# Altium project 继电器控制模块.PrjPCB
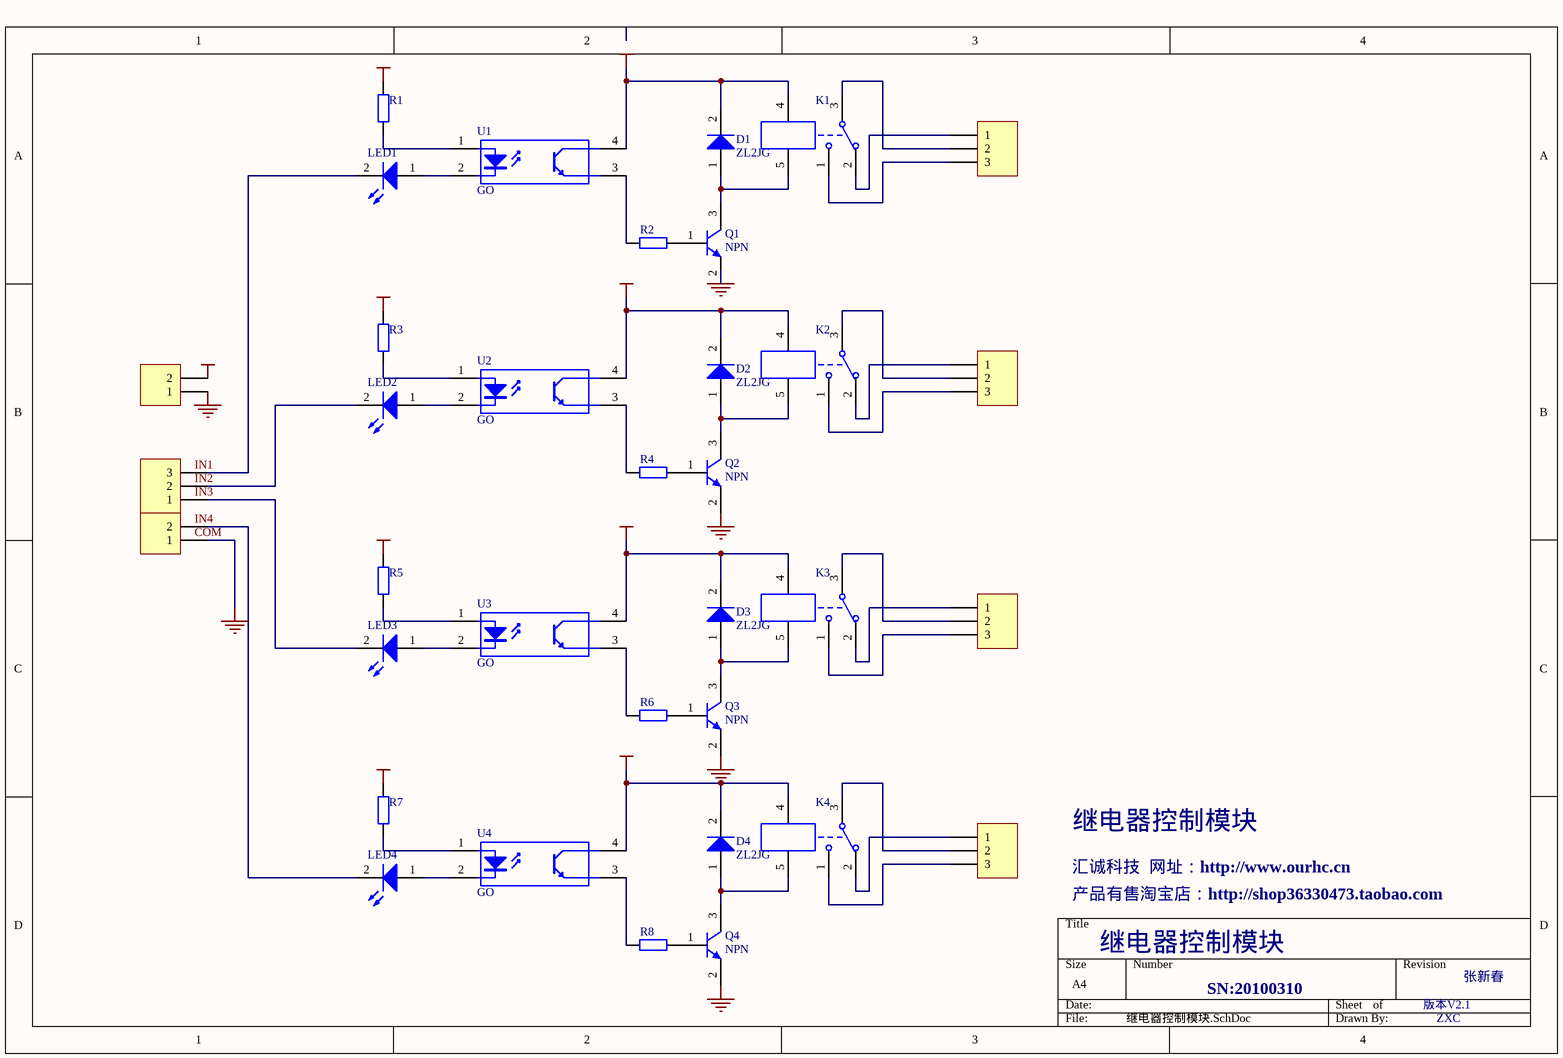
[diagram p0: 继电器控制模块.SchDoc]
1 sheet, 35 parts. Net scope: global (net labels, ports and power ports of the same name join across sheets).
Board file: 继电器控制模块.PcbDoc

## Sheet 继电器控制模块.SchDoc
size A4

### Parts
D1  ZL2JG  [TPDR]
D2  ZL2JG  [TPDR]
D3  ZL2JG  [TPDR]
D4  ZL2JG  [TPDR]
IN1  PZ_3  [JK128_3]  (value not drawn)
IN2  PZ_2  [JK128_2]  (value not drawn)
K1  JDQYCK  [JQC-3F/T73]  (value not drawn)
K2  JDQYCK  [JQC-3F/T73]  (value not drawn)
K3  JDQYCK  [JQC-3F/T73]  (value not drawn)
K4  JDQYCK  [JQC-3F/T73]  (value not drawn)
LED1  (no value)  [TP-0805-D]
LED2  (no value)  [TP-0805-D]
LED3  (no value)  [TP-0805-D]
LED4  (no value)  [TP-0805-D]
OUT1  PZ_3  [JK128_3]  (value not drawn)
OUT2  PZ_3  [JK128_3]  (value not drawn)
OUT3  PZ_3  [JK128_3]  (value not drawn)
OUT4  PZ_3  [JK128_3]  (value not drawn)
POWER  PZ_2  [JK128_2]  (value not drawn)
Q1  NPN  [SO-G3]
Q2  NPN  [SO-G3]
Q3  NPN  [SO-G3]
Q4  NPN  [SO-G3]
R1  Res  [TP-0805-R]  (value not drawn)
R2  Res  [TP-0805-R]  (value not drawn)
R3  Res  [TP-0805-R]  (value not drawn)
R4  Res  [TP-0805-R]  (value not drawn)
R5  Res  [TP-0805-R]  (value not drawn)
R6  Res  [TP-0805-R]  (value not drawn)
R7  Res  [TP-0805-R]  (value not drawn)
R8  Res  [TP-0805-R]  (value not drawn)
U1  GO  [DIP-4]
U2  GO  [DIP-4]
U3  GO  [DIP-4]
U4  GO  [DIP-4]

### Nets
GND: IN2.1 POWER.1 Q1.2(E) Q2.2(E) Q3.2(E) Q4.2(E)
VCC: D1.2(K) D2.2(K) D3.2(K) D4.2(K) K1.4 K2.4 K3.4 K4.4 POWER.2 R1.2 R3.2 R5.2 R7.2 U1.4(C) U2.4(C) U3.4(C) U4.4(C)
NetD1_1: D1.1(A) K1.5 Q1.3(C)
NetD2_1: D2.1(A) K2.5 Q2.3(C)
NetD3_1: D3.1(A) K3.5 Q3.3(C)
NetD4_1: D4.1(A) K4.5 Q4.3(C)
NetIN1_1: IN1.1 LED3.2(K)
NetIN1_2: IN1.2 LED2.2(K)
NetIN1_3: IN1.3 LED1.2(K)
NetIN2_2: IN2.2 LED4.2(K)
NetK1_1: K1.1 OUT1.3
NetK1_2: K1.2 OUT1.1
NetK1_3: K1.3 OUT1.2
NetK2_1: K2.1 OUT2.3
NetK2_2: K2.2 OUT2.1
NetK2_3: K2.3 OUT2.2
NetK3_1: K3.1 OUT3.3
NetK3_2: K3.2 OUT3.1
NetK3_3: K3.3 OUT3.2
NetK4_1: K4.1 OUT4.3
NetK4_2: K4.2 OUT4.1
NetK4_3: K4.3 OUT4.2
NetLED1_1: LED1.1(A) U1.2(K)
NetLED2_1: LED2.1(A) U2.2(K)
NetLED3_1: LED3.1(A) U3.2(K)
NetLED4_1: LED4.1(A) U4.2(K)
NetQ1_1: Q1.1(B) R2.1
NetQ2_1: Q2.1(B) R4.1
NetQ3_1: Q3.1(B) R6.1
NetQ4_1: Q4.1(B) R8.1
NetR1_1: R1.1 U1.1(A)
NetR2_2: R2.2 U1.3(E)
NetR3_1: R3.1 U2.1(A)
NetR4_2: R4.2 U2.3(E)
NetR5_1: R5.1 U3.1(A)
NetR6_2: R6.2 U3.3(E)
NetR7_1: R7.1 U4.1(A)
NetR8_2: R8.2 U4.3(E)

### Notes on the sheet
- 继电器控制模块
- 汇诚科技  网址：http://www.ourhc.cn
- 产品有售淘宝店：http://shop36330473.taobao.com
- SN:20100310
- 版本V2.1
- 张新春
- ZXC
- Labels drawn without touching a wire or pin: COM, IN1, IN2, IN3, IN4

### Library data of the parts
D1-D4 = ZL2JG: 整流二极管; Published: 8-Jun-2000; LatestRevisionDate: 17-Jul-2002; LatestRevisionNote: Re-released for DXP Platform.; DatasheetDocument: 1998; PackageDocument: Aug-1999; PackageReference: DO-201AD; Publisher: Altium Limited
IN1 OUT1-OUT4 = PZ_3: 排针——3; LatestRevisionDate: 17-Jul-2002; LatestRevisionNote: Re-released for DXP Platform.; Publisher: Altium Limited
IN2 POWER = PZ_2: 排针——2; LatestRevisionDate: 17-Jul-2002; LatestRevisionNote: Re-released for DXP Platform.; Publisher: Altium Limited
K1-K4 = JDQYCK: 继电器——1常开1常闭; Published: 24-Mar-1999; LatestRevisionDate: 17-Jul-2002; LatestRevisionNote: Re-released for DXP Platform.; Publisher: Altium Limited
LED1-LED4 = LED: 发光二极管; Published: 8-Jun-2000; LatestRevisionDate: 17-Jul-2002; LatestRevisionNote: Re-released for DXP Platform.; Publisher: Altium Limited
Q1-Q4 = NPN: NPN Bipolar Transistor; Published: 8-Jun-2000; LatestRevisionDate: 17-Jul-2002; LatestRevisionNote: Re-released for DXP Platform.; Publisher: Altium Limited; Code_JEDEC: TO-226-AA
R1-R8 = Res: 电阻; Value: 1K; Published: 8-Jun-2000; LatestRevisionDate: 17-Jul-2002; LatestRevisionNote: Re-released for DXP Platform.; Publisher: Altium Limited
U1-U4 = GO: 光耦; Published: 24-Mar-1999; LatestRevisionDate: 17-Jul-2002; LatestRevisionNote: Re-released for DXP Platform.; Publisher: Altium Limited